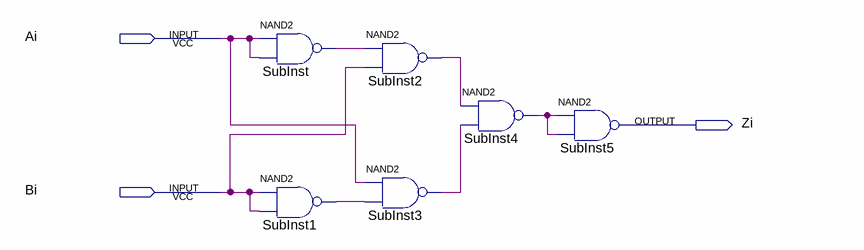
[diagram p0: schematic sheet]
// Quartus schematic Exp4_SubCirc_Arch.bdf as structural Verilog: 6 symbols, 3 pins
module Exp4_SubCirc_Arch (
  input  Ai,
  input  Bi,
  output Zi
);

  wire SubInst1_out, SubInst2_out, SubInst3_out, SubInst4_out, SubInst_out;

  nand SubInst (SubInst_out, Ai, Ai);
  nand SubInst1 (SubInst1_out, Bi, Bi);
  nand SubInst2 (SubInst2_out, SubInst_out, Bi);
  nand SubInst3 (SubInst3_out, Ai, SubInst1_out);
  nand SubInst4 (SubInst4_out, SubInst2_out, SubInst3_out);
  nand SubInst5 (Zi, SubInst4_out, SubInst4_out);
endmodule
